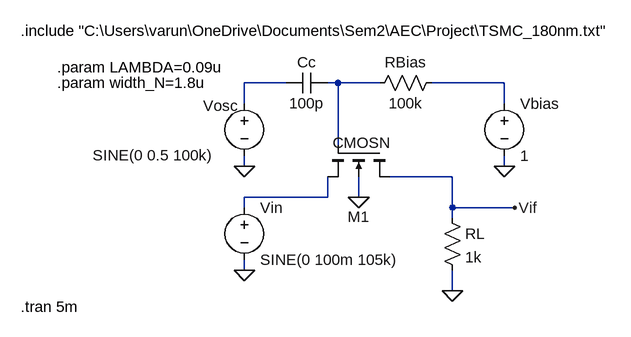
[diagram p0: schematic Mixer.asc]
Mixer.asc, the LTspice schematic file:
Version 4
SHEET 1 880 680
WIRE 160 64 96 64
WIRE 240 64 224 64
WIRE 304 64 240 64
WIRE 496 64 384 64
WIRE 96 96 96 64
WIRE 496 96 496 64
WIRE 240 160 240 64
WIRE 96 192 96 176
WIRE 496 192 496 176
WIRE 416 208 320 208
WIRE 224 240 224 208
WIRE 224 240 96 240
WIRE 272 240 272 208
WIRE 96 256 96 240
WIRE 416 256 416 208
WIRE 512 256 416 256
WIRE 416 272 416 256
WIRE 96 352 96 336
WIRE 416 384 416 352
FLAG 96 192 0
FLAG 496 192 0
FLAG 272 240 0
FLAG 96 352 0
FLAG 416 384 0
FLAG 512 256 Vif
SYMBOL voltage 96 80 R0
WINDOW 0 -63 19 Left 2
WINDOW 3 -233 95 Left 2
WINDOW 123 0 0 Left 0
WINDOW 39 0 0 Left 0
SYMATTR InstName Vosc
SYMATTR Value SINE(0 0.5 100k)
SYMBOL cap 224 48 R90
WINDOW 0 0 32 VBottom 2
WINDOW 3 32 32 VTop 2
SYMATTR InstName Cc
SYMATTR Value 100p
SYMBOL res 400 48 R90
WINDOW 0 0 56 VBottom 2
WINDOW 3 32 56 VTop 2
SYMATTR InstName RBias
SYMATTR Value 100k
SYMBOL voltage 496 80 R0
SYMATTR InstName Vbias
SYMATTR Value 1
SYMBOL voltage 96 240 R0
WINDOW 123 0 0 Left 0
WINDOW 39 0 0 Left 0
SYMATTR InstName Vin
SYMATTR Value SINE(0 100m 105k)
SYMBOL nmos4 320 160 R90
WINDOW 0 110 31 VRight 2
WINDOW 3 -4 -1 VRight 2
SYMATTR InstName M1
SYMATTR Value CMOSN
SYMATTR Value2 l={2*LAMBDA} w={width_N} ad={5*width_N*LAMBDA} as={5*width_N*LAMBDA} pd={10*LAMBDA + 2*width_N} ps={10*LAMBDA + 2*width_N} m=1
SYMBOL res 400 256 R0
SYMATTR InstName RL
SYMATTR Value 1k
TEXT -192 40 Left 2 !.param LAMBDA=0.09u
TEXT -192 64 Left 2 !.param width_N=1.8u
TEXT -248 -16 Left 2 !.include "C:\\Users\\varun\\OneDrive\\Documents\\Sem2\\AEC\\Project\\TSMC_180nm.txt"
TEXT -248 408 Left 2 !.tran 5m

The netlist it stands for:
* Mixer.asc
Vosc N001 0 SINE(0 0.5 100k)
Cc N002 N001 100p
RBias N003 N002 100k
Vbias N003 0 1
Vin N004 0 SINE(0 100m 105k)
M1 Vif N002 N004 0 CMOSN l={2*LAMBDA} w={width_N} ad={5*width_N*LAMBDA} as={5*width_N*LAMBDA} pd={10*LAMBDA + 2*width_N} ps={10*LAMBDA + 2*width_N} m=1
RL Vif 0 1k
.model NMOS NMOS
.model PMOS PMOS
.lib standard.mos
.param LAMBDA=0.09u
.param width_N=1.8u
.include "C:\Users\varun\OneDrive\Documents\Sem2\AEC\Project\TSMC_180nm.txt"
.tran 5m
.backanno
.end